# EAGLE design tram.stop (EAGLE 6.5.0)
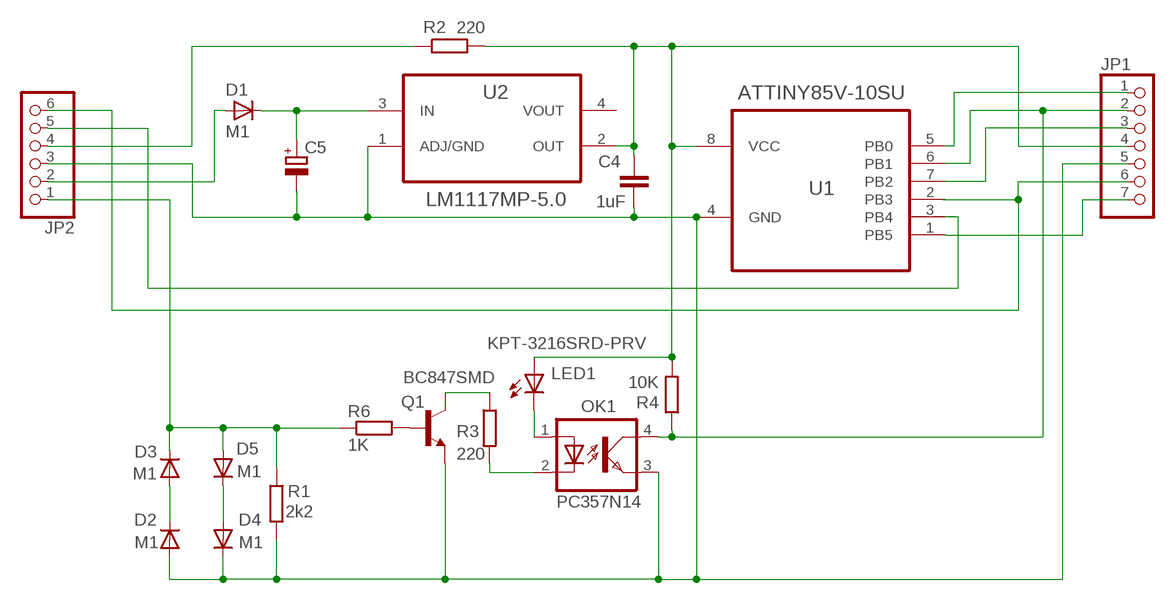
[diagram p0: schematic, sheet 1]

## Parts
C4  1uF  C-EUC0402  [C0402]
C5  CPOL-EUSMCD  [SMC_D]
D1  M1  ES2D  [SMB]
D2  M1  ES2D  [SMB]
D3  M1  ES2D  [SMB]
D4  M1  ES2D  [SMB]
D5  M1  ES2D  [SMB]
JP1  PINHD-1X7  [1X07]
JP2  PINHD-1X6/90  [1X06/90]
LED1  KPT-3216SRD-PRV  LEDSML1206  [SML1206]
OK1  PC357N14  LTV816S  [SMD4]
Q1  BC847SMD  [SOT23]
R1  2k2  R-EU_R1206  [R1206]
R2  220  R-EU_R1206  [R1206]
R3  220  R-EU_R1206  [R1206]
R4  10K  R-EU_R1206  [R1206]
R6  1K  R-EU_R1206  [R1206]
U1  ATTINY85V-10SU  [SOIC127P798X216-8N]
U2  LM1117MP-5.0  [SOT230P696X180-4N]

## Nets
220: LED1.C OK1.1(A)
JP1: D3.C D5.A JP2.1 R1.1 R6.1
JP2: C4.2 D2.A D4.C JP1.5 JP2.3 OK1.3(EMIT) Q1.2(E) R1.2 U1.4(GND) U2.1(ADJ/GND)
N$2: U1.2(PB3)
N$4: D2.C D3.A
N$5: D4.A D5.C
N$6: Q1.1(B) R6.2
N$7: Q1.3(C) R3.1
N$9: OK1.2(C) R3.2
N$10: JP1.3 U1.7(PB2)
N$11: JP1.1 U1.5(PB0)
N$12: JP2.4 R2.1
N$13: JP1.6 JP2.6
N$14: JP1.2 OK1.4(COL) R4.1 U1.6(PB1)
N$15: C4.1 JP1.4 LED1.A R2.2 R4.2 U1.8(VCC) U2.2(OUT)
N$16: JP1.7 U1.1(PB5)
N$21: D1.A JP2.2
N$22: C5.+ D1.C U2.3(IN)
RED2: JP2.5 U1.3(PB4)
Unconnected: C5.- U2.4(VOUT)

## Library data of the parts
C4 = rcl:C-EU: CAPACITOR, European symbol
C5 = rcl:CPOL-EU: POLARIZED CAPACITOR, European symbol
D1-D5 = diode:ES2D: DIODE super fast rectifier, 2 A
JP1 = pinhead:PINHD-1X7: PIN HEADER
JP2 = pinhead:PINHD-1X6: PIN HEADER
LED1 = led:LED: LED OSRAM: - CHIPLED LG R971, LG N971, LY N971, LG Q971, LY Q971, LO R971, LY R971 LH N974, LH R974 LS Q976, LO Q976, LY Q976 LO Q996 - Hyper CHIPLED LW Q18S LB Q993, LB Q99A, LB R99A - SideLED LS A670, LO A670, LY A670, LG A670, LP A670 LB A673, LV A673, LT A673, LW A673 LH A674 LY A675 LS A676, LA A676, LO A676, LY A676, LW A676 LS A679, LY A679, LG A679 - Hyper Micro SIDELED® LS Y876, LA Y876, LO Y876, LY Y876 LT Y87S - SmartLED LW L88C, LW L88S LB L89C, LB L89S, LG L890 LS L89K, LO L89K, LY L89K LS L896, LA L896, LO L896, LY L896 - TOPLED LS T670, LO T670, LY T670, LG T670, LP T670 LSG T670, LSP T670, LSY T670, LOP T670, LYG T670 LG T671, LOG T671, LSG T671 LB T673, LV T673, LT T673, LW T673 LH T674 LS T676, LA T676, LO T676, LY T676, LB T676, LH T676, LSB T676, LW T676 LB T67C, LV T67C, LT T67C, LS T67K, LO T67K, LY T67K, LW E67C LS E67B, LA E67B, LO E67B, LY E67B, LB E67C, LV E67C, LT E67C LW T67C LS T679, LY T679, LG T679 LS T770, LO T770, LY T770, LG T770, LP T770 LB T773, LV T773, LT T773, LW T773 LH T774 LS E675, LA E675, LY E675, LS T675 LS T776, LA T776, LO T776, LY T776, LB T776 LHGB T686 LT T68C, LB T68C - Hyper Mini TOPLED® LB M676 - Mini TOPLED Santana® LG M470 LS M47K, LO M47K, LY M47K Source: http://www.osram.convergy.de LUXEON: - LUMILED® LXK2-PW12-R00, LXK2-PW12-S00, LXK2-PW14-U00, LXK2-PW14-V00 LXK2-PM12-R00, LXK2-PM12-S00, LXK2-PM14-U00 LXK2-PE12-Q00, LXK2-PE12-R00, LXK2-PE12-S00, LXK2-PE14-T00, LXK2-PE14-U00 LXK2-PB12-K00, LXK2-PB12-L00, LXK2-PB12-M00, LXK2-PB14-N00, LXK2-PB14-P00, LXK2-PB14-Q00 LXK2-PR12-L00, LXK2-PR12-M00, LXK2-PR14-Q00, LXK2-PR14-R00 LXK2-PD12-Q00, LXK2-PD12-R00, LXK2-PD12-S00 LXK2-PH12-R00, LXK2-PH12-S00 LXK2-PL12-P00, LXK2-PL12-Q00, LXK2-PL12-R00 Source: www.luxeon.com KINGBRIGHT: KA-3528ASYC Source: www.kingbright.com
OK1 = optocoupler:LTV816: OPTO COUPLER Source: LITEON, LTV816.pdf; OC_FARNELL: unknown; OC_NEWARK: unknown
Q1 = transistor-npn:BC847*: NPN Transistor
R1-R4 R6 = rcl:R-EU_: RESISTOR, European symbol
U1 = Attiny85:ATTINY85V-10SU: 8-bit Microcontroller with In-System Programmable Flash; MPN: ATTINY85V-10SU; OC_FARNELL: 1455166; OC_NEWARK: 58M3799; PACKAGE: SOIC-8; SUPPLIER: Atmel
U2 = LM1117:LM1117MP-5.0: Linear regulators; MPN: LM1117MP-5.0; OC_FARNELL: 9778209; OC_NEWARK: 41K3471; PACKAGE: SOT223-3; SUPPLIER: NationalSemiconductor

## Board
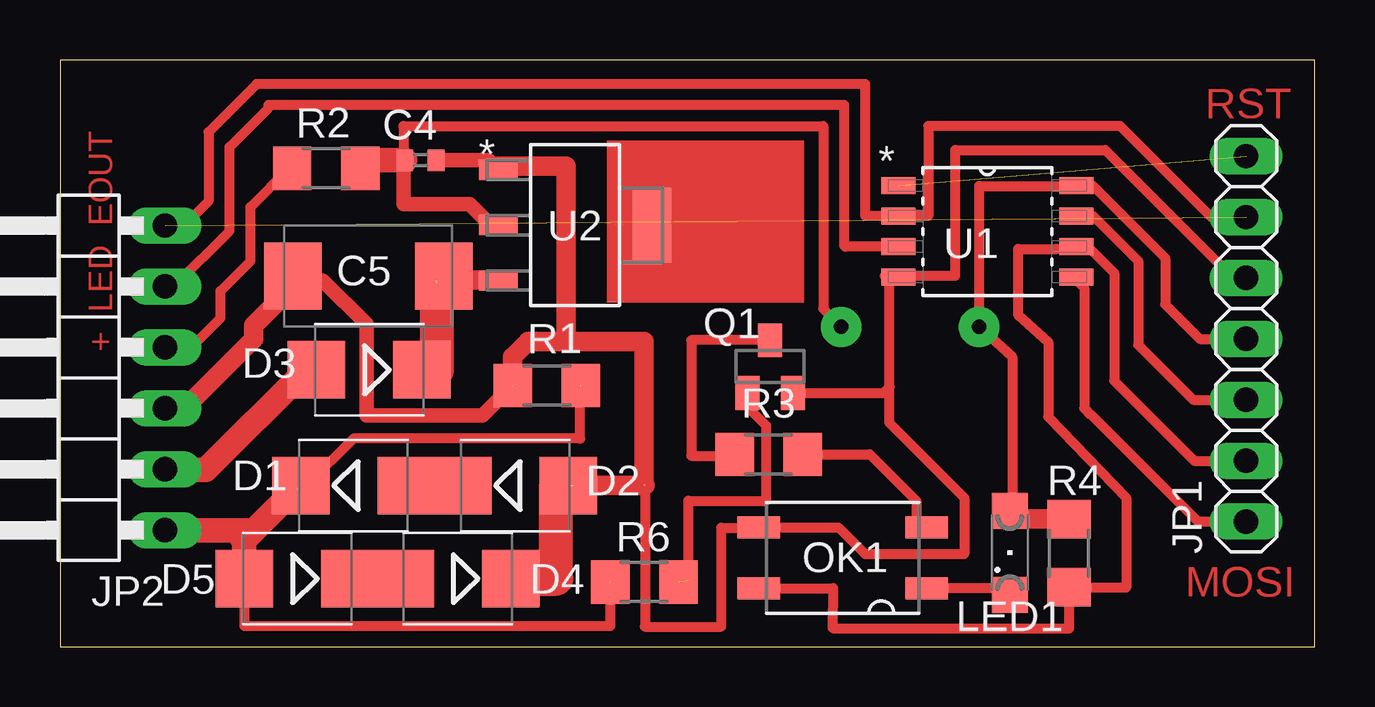
[diagram p1: board, top side]
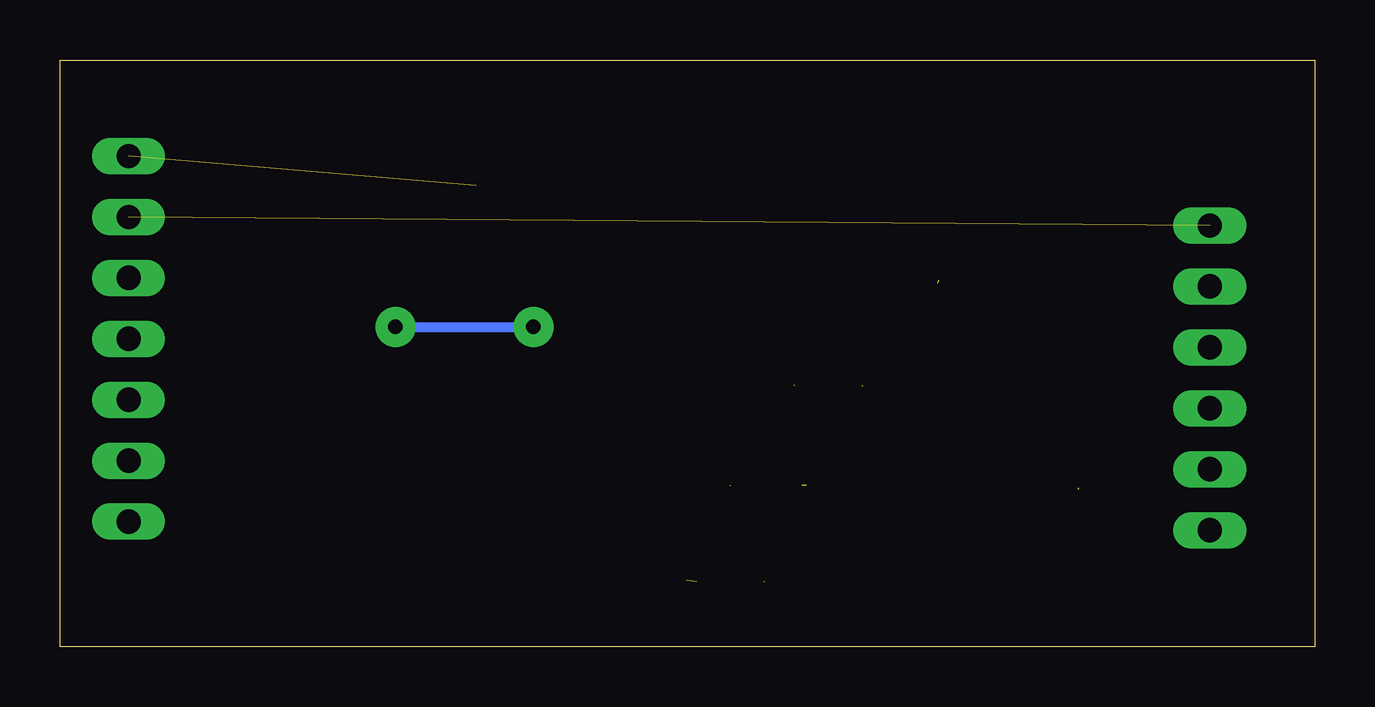
[diagram p2: board, bottom side, seen from below]

Size 52.3 x 24.46 mm. Coordinates in mm from the lower left corner, seen from the top.
Outline: 0,0 52.3,0 52.3,24.46 0,24.46 0,0
Copper layers (1*16): Top 0.035mm / dielectric 1.5mm / Bottom 0.035mm
Design rules "default": minimum track width 10mil, minimum drill 24mil, track to track 8mil, track to pad 8mil, pad to pad 8mil, via to via 8mil, smd to smd 8mil, copper to edge 40mil, drill to drill 8mil, minimum pad ring 10mil, minimum via ring 8mil, stop-mask expansion 4mil, vias tented up to drill 0mil, thermal gap 10mil

### Footprints (pad centres in the part's own frame; a part is rotated, then mirrored left to right if it is on the bottom)
C0402 = smd 0.7 x 0.9: 1 -0.65,0; 2 0.65,0
SMC_D = smd 2.4 x 2.8: + -3.15,0; - 3.15,0
SMB = smd 2.4 x 2.4: A 2.2,0; C -2.2,0
1X07 = drill 1.016 long: 1 -7.62,0; 2 -5.08,0; 3 -2.54,0; 4 0,0; 5 2.54,0; 6 5.08,0; 7 7.62,0
1X06/90 = drill 1.016 long: 1 -6.35,-3.81; 2 -3.81,-3.81; 3 -1.27,-3.81; 4 1.27,-3.81; 5 3.81,-3.81; 6 6.35,-3.81
SML1206 = smd 1.5 x 1.5: A 1.75,0; C -1.75,0
SMD4 = smd 0.914 x 1.778: 1 -1.27,-3.5; 2 1.27,-3.5; 3 1.27,3.5; 4 -1.27,3.5
SOT23 = smd 1 x 1.4: 1 -0.95,-1.1; 2 0.95,-1.1; 3 0,1.1
R1206 = smd 1.6 x 1.803: 1 -1.422,0; 2 1.422,0
SOIC127P798X216-8N = smd 1.422 x 0.711: 1 -3.708,1.905; 2 -3.708,0.635; 3 -3.708,-0.635; 4 -3.708,-1.905; 5 3.708,-1.905; 6 3.708,-0.635; 7 3.708,0.635; 8 3.708,1.905
SOT230P696X180-4N = smd 1.6 x 0.838: 1 -3.2,2.311; 2 -3.2,0; 3 -3.2,-2.311 | smd 1.6 x 3.099: 4 3.2,0

### Placement (x,y rotation side)
C4  15.03,20.28 0 top
C5  12.85,15.46 180 top
D1  12.89,11.54 180 top
D2  18.99,6.72 0 top
D3  12.24,6.72 0 top
D4  16.59,2.83 180 top
D5  9.89,2.83 180 top
JP1  49.44,12.83 90 top
JP2  0.57,11.21 90 top
LED1  39.59,3.92 90 top
OK1  32.62,3.7 90 top
Q1  29.6,11.68 0 top
R1  20.29,10.89 180 top
R2  11.1,19.94 0 top
R3  29.54,8.01 0 top
R4  42.06,3.9 90 top
R6  24.36,2.69 0 top
U1  38.66,17.31 0 top
U2  21.47,17.57 0 top

### Tracks (layer width: path | path; a pad name or v marks a point on that pad's centre or on a via)
220
  Top 0.406: LED1.C 39.05,2.43 OK1.1
JP1  (3 unrouted)
  Top 0.406: 10.26,6.72 12.24,8.67 21.69,8.67 21.69,10.9 | D5.A 7.69,0.85 22.94,0.85 22.94,2.72 22.93,2.73
  Top 1.016: 7.68,2.84 7.68,4.43 | 7.68,4.43 8.01,4.76 | 8.01,4.76 9.87,6.62 | 7.29,4.82 7.68,4.43 | JP2.1 7.92,4.86 8.01,4.76
  Top 1.27: D5.A 7.68,2.84 | 10.26,6.72 D3.C 9.88,6.56
JP2  (3 unrouted)
  Top 0.305: 10.17,15.49 9.93,15.26
  Top 0.406: 10.95,15.26 9.93,15.26 | 24.38,6.73 24.38,0.83 27.57,0.83 27.57,4.96 28.61,4.96 OK1.3 32.44,4.97 33.55,3.86 37.68,3.86 37.69,3.87 37.69,6.21 34.58,9.32 34.58,10.83 | 21.1,12.73 21.2,12.63 | 35.07,15.46 37.32,15.46 37.32,20.71 43.57,20.71 48.9,15.37 JP1.5 | 35.07,15.46 34.38,15.46 34.58,15.26 34.58,10.83 | Q1.2 34.32,10.58 34.58,10.83 | U1.4 35.02,15.41 35.07,15.46
  Top 0.61: 10.95,15.26 12.79,13.44 12.79,9.63 17.62,9.63 R1.2 | C4.2 17.86,20.28 U2.1
  Top 0.813: 24.38,6.73 23.71,6.73 21.39,6.73 | 24.35,6.73 24.35,12.72 19.5,12.72 | 20.69,6.74 21.19,6.74 D2.A | 19.5,12.72 18.87,12.08 18.87,10.86 | 19.5,12.72 19.52,12.73 21.1,12.73 21.1,20.03 18.29,20.03 U2.1 | JP2.3 5.17,9.94 8.07,12.83 8.07,13.39 9.93,15.26
  Top 1.422: D4.C 20.69,2.83 20.69,6.74
N$2
  Top 0.406: U1.2 34.84,17.96 36.19,17.96 36.19,21.71 44.19,21.71 47.99,17.91
N$4
  Top 0.406: D3.A D2.C
N$5
  Top 0.406: D5.C D4.A
N$6  (1 unrouted)
  Top 0.406: 26.19,2.76 26.19,6.08 29.44,6.08 29.44,9.21 28.69,9.96 28.69,10.78 Q1.1
N$7
  Top 0.406: Q1.3 26.32,12.78 26.32,7.96 28.12,7.96 R3.1
N$8
  Top 0.406: 34.82,17.96 33.57,17.96 33.57,23.46 8.19,23.46 6.19,21.46 6.19,18.58 5.07,17.46
N$9
  Top 0.406: OK1.2 35.62,4.97 35.69,5.04 35.69,6.08 33.76,8.01 R3.2
N$10
  Top 0.406: U1.7 43.08,17.95 44.94,16.08 44.94,12.58 47.23,10.29 JP1.3
N$11
  Top 0.406: 41.94,15.36 U1.5 42.37,15.28 42.69,14.96 42.69,9.94 42.99,9.64 43,9.64 47.44,5.21 JP1.1
N$12
  Top 0.406: R2.1 9.55,19.94 7.94,18.33 7.94,16.08 6.69,14.83 6.69,13.71 5.44,12.46 4.4,12.46 JP2.4
N$13  (1 unrouted)
N$14
  Top 0.406: OK1.4 32.22,2.43 32.21,0.77 42.07,0.76 42.07,2.01 R4.1 | 41.7,2.48 41.69,2.47 R4.1 | U1.6 42.35,16.68 | U1.6 41.52,16.58 39.94,16.58 39.94,13.83 41.19,12.71 41.19,9.58 44.44,6.21 44.44,2.46 42.08,2.46 R4.1 | U1.6 42.09,16.58 42.94,16.58 43.94,15.58 43.94,11.08 47.27,7.75 JP1.2
N$15  (via drill 0.6 pad 1.68)
  Top 0.406: LED1.A 39.69,5.69 39.69,12.08 v38.32,13.33 38.32,19.21 41.73,19.21 U1.8 43.06,19.22 46.07,16.21 46.07,14.27 47.5,12.83 JP1.4 | v32.57,13.33 31.82,14.08 31.82,21.71 14.32,21.71 14.32,20.34
  Top 0.61: 14.32,20.34 C4.1 14.32,20.22 14.32,18.46 17.07,18.46 17.83,17.69 U2.2
  Top 0.813: R4.2 39.44,5.32 LED1.A
  Top 1.016: C4.1 12.73,20.28 R2.2
  Bottom 0.406: v38.32,13.33 v32.57,13.33
N$16  (1 unrouted)
N$21
  Top 1.016: D1.A 10.25,11.54 6.08,7.37 4.4,7.37 JP2.2
N$22  (1 unrouted)
  Top 0.813: D1.C 15.71,11.53 | U2.3 18.24,15.28 15.68,15.28
  Top 1.422: 15.71,11.53 15.71,15.17 C5.+
RED2
  Top 0.406: U1.3 32.72,16.68 32.69,16.71 32.69,22.58 8.69,22.58 8.69,22.46 7.07,20.83 7.07,17.33 4.8,15.07 4.43,15.07 JP2.5
(copper drawn outside any net)
  shapes: Top area x2

### Text on the board
Top: RST | + LED EOUT | MOSI
tDocu: + | 12V | - | ČERVENÁ LED1 | +5V LED | KOLEJIŠTĚ, -12V | +12V | IZOLOVANÁ KOLEJ